# Altium schematic sheet CCD.SchDoc
size A4; SheetNumber: 4; SheetTotal: 5
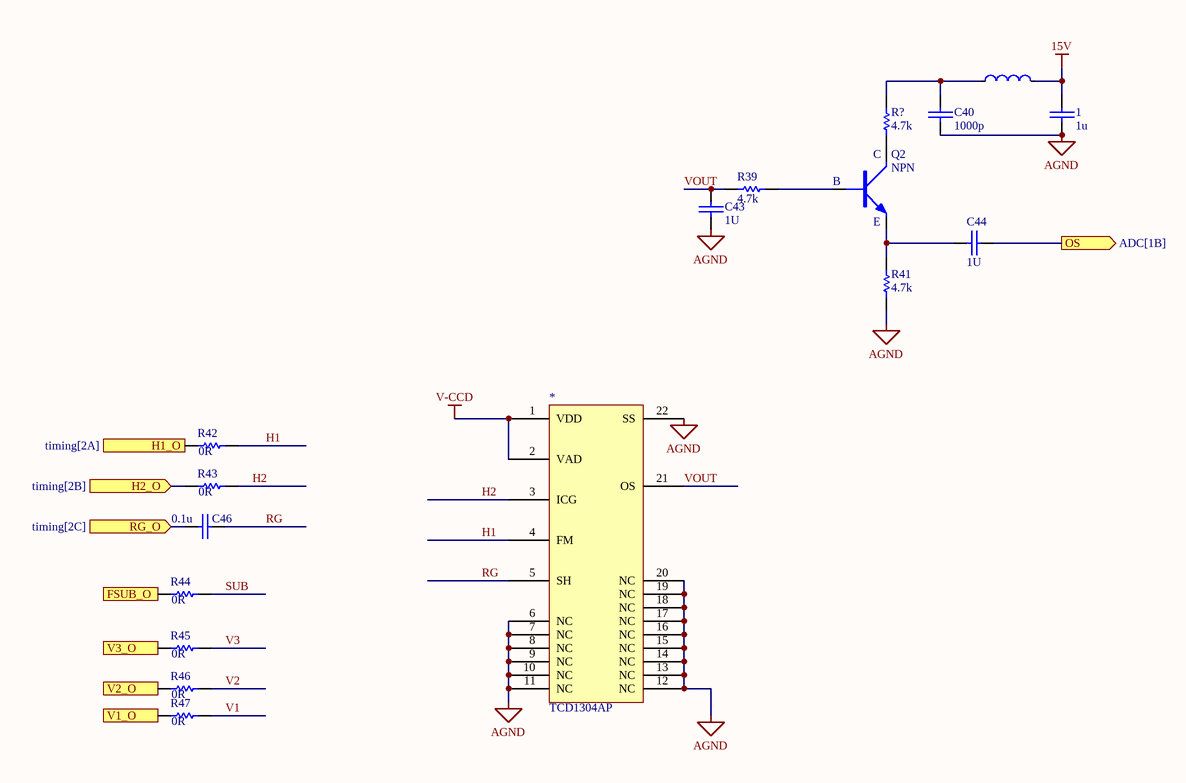
[diagram p0: CCD.SchDoc]

## Parts
1  1u  [0603C]
*  TCD1304AP  [TCD1304AP]
C40  1000p  [0603C]
C43  1U  [0603C]
C44  1U  [0603C]
C46  0.1u  [0603C]
L11  GZ1608D601TF  [0603L]  (value not drawn)
Q2  NPN  [SOT23-3]
R39  4.7k  [0603R]
R41  4.7k  [0603R]
R42  0R  [0603R]
R43  0R  [0603R]
R44  0R  [0603R]
R45  0R  [0603R]
R46  0R  [0603R]
R47  0R  [0603R]
R?  4.7k  [0603R]

## Ports
FSUB_O (in), H1_O (in, see timing[2A]), H2_O (in, see timing[2B]), OS (out, see ADC[1B]), RG_O (in, see timing[2C]), V1_O (in), V2_O (in), V3_O (in)

## Nets
15V: 1.2 L11.2
AGND: 1.1 *.6(NC) *.7(NC) *.8(NC) *.9(NC) *.10(NC) *.11(NC) *.12(NC) *.13(NC) *.14(NC) *.15(NC) *.16(NC) *.17(NC) *.18(NC) *.19(NC) *.20(NC) *.22(SS) C40.1 C43.2 R41.1
V-CCD: *.1(VDD) *.2(VAD)
FSUB_O: R44.2 ; port FSUB_O
H1: *.4(FM) R42.1
H1_O: R42.2 ; port H1_O
H2: *.3(ICG) R43.1
H2_O: R43.2 ; port H2_O
OS: C44.1 ; port OS
RG: *.5(SH) C46.1
RG_O: C46.2 ; port RG_O
SUB: R44.1
V1: R47.1
V1_O: R47.2 ; port V1_O
V2: R46.1
V2_O: R46.2 ; port V2_O
V3: R45.1
V3_O: R45.2 ; port V3_O
VOUT: *.21(OS) C43.1 R39.2
NetC40_2: C40.2 L11.1 R?.1
NetC44_2: C44.2 Q2.2(E) R41.2
NetQ2_1: Q2.1(B) R39.1
NetQ2_3: Q2.3(C) R?.2

## Library data of the parts
1 C40 C43 C44 C46 = CAP: 无极性电容
* = TCD1304AP: 排母
L11 = FB: 铁氧体磁珠; Manufacturer: Sunlord(顺络); Add into BOM: yes; Impedance @ Frequency: 600Ω@100MHz; Tolerance: ±25%; DC Resistance: 450mΩ; Current Rating: 200mA; Circuits: 1; Name: GZ1608D601TF; Symbol: GZ1608D601TF; Device: GZ1608D601TF; LCSC Part Name: 600Ω@100MHz ±25%; Supplier Part: C1002; Manufacturer Part: GZ1608D601TF; Supplier Footprint: 0603; JLCPCB Part Class: Basic Part; Datasheet: https://atta.szlcsc.com/upload/public/pdf/source/20210830/355EA7C0FAC5394FC0FE3F17C770C20A.pdf; Supplier: LCSC; Convert to PCB: yes
Q2 = NPN: NPN三极管
R39 R41-R47 R? = RES: 电阻